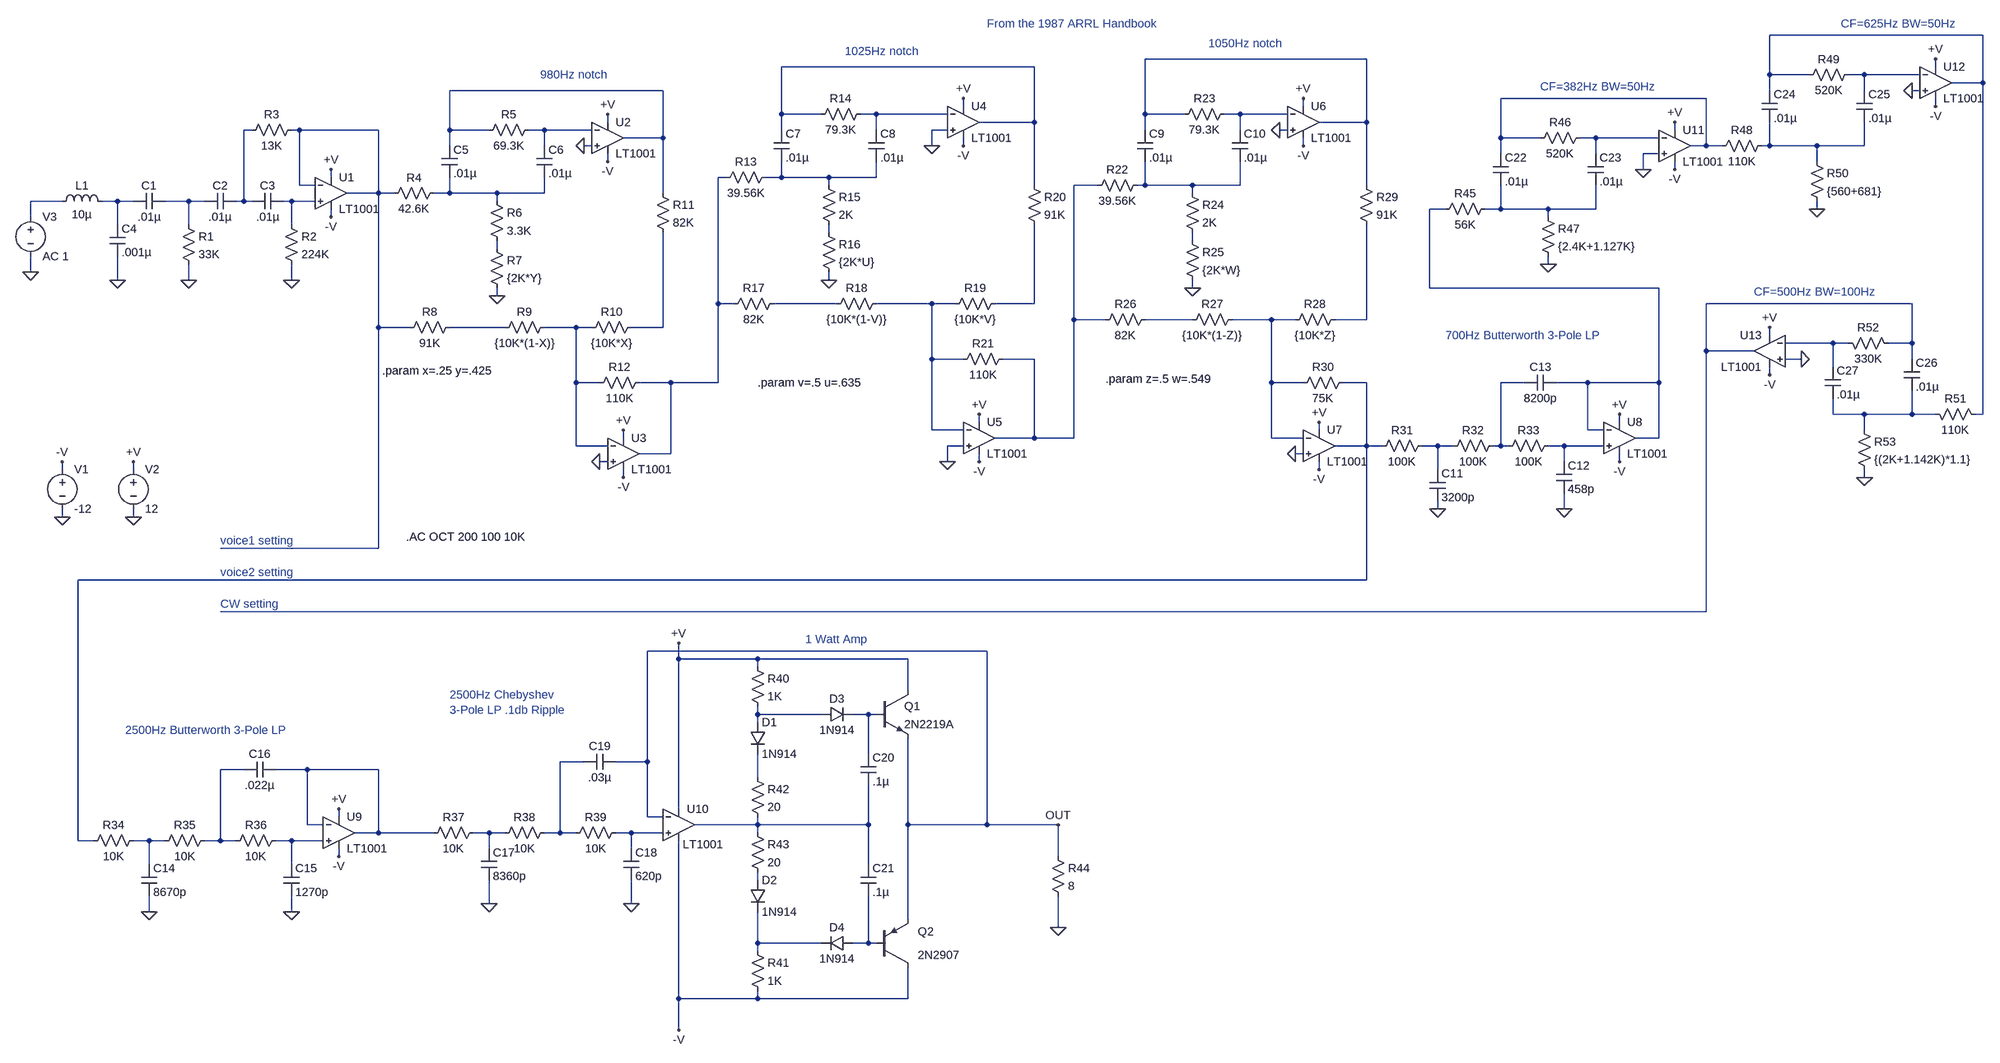
[diagram p0: schematic voice.asc]
voice.asc, the LTspice schematic file:
Version 4
SHEET 1 5368 2104
WIRE 4896 -64 4464 -64
WIRE 3648 -16 3200 -16
WIRE 2976 0 2464 0
WIRE 4800 0 4800 -16
WIRE 4464 16 4464 -64
WIRE 4544 16 4464 16
WIRE 4656 16 4624 16
WIRE 4768 16 4656 16
WIRE 4896 32 4896 -64
WIRE 4896 32 4832 32
WIRE 2224 48 1792 48
WIRE 4464 48 4464 16
WIRE 4656 48 4656 16
WIRE 4768 48 4752 48
WIRE 4336 64 3920 64
WIRE 2832 80 2832 64
WIRE 3520 80 3520 64
WIRE 4800 80 4800 64
WIRE 2464 96 2464 0
WIRE 2544 96 2464 96
WIRE 2656 96 2624 96
WIRE 2800 96 2656 96
WIRE 3200 96 3200 -16
WIRE 3280 96 3200 96
WIRE 3392 96 3360 96
WIRE 3488 96 3392 96
WIRE 2112 112 2112 96
WIRE 2976 112 2976 0
WIRE 2976 112 2864 112
WIRE 3648 112 3648 -16
WIRE 3648 112 3552 112
WIRE 1392 128 1376 128
WIRE 1488 128 1472 128
WIRE 1648 128 1488 128
WIRE 1792 128 1792 48
WIRE 1872 128 1792 128
WIRE 1984 128 1952 128
WIRE 2080 128 1984 128
WIRE 2464 128 2464 96
WIRE 2656 128 2656 96
WIRE 2800 128 2768 128
WIRE 3200 128 3200 96
WIRE 3392 128 3392 96
WIRE 3488 128 3472 128
WIRE 4272 128 4272 112
WIRE 2224 144 2224 48
WIRE 2224 144 2144 144
WIRE 3920 144 3920 64
WIRE 4000 144 3920 144
WIRE 4112 144 4080 144
WIRE 4240 144 4112 144
WIRE 1792 160 1792 128
WIRE 1984 160 1984 128
WIRE 2080 160 2064 160
WIRE 2768 160 2768 128
WIRE 2832 160 2832 144
WIRE 3520 160 3520 144
WIRE 4336 160 4336 64
WIRE 4336 160 4304 160
WIRE 4368 160 4336 160
WIRE 4464 160 4464 112
WIRE 4464 160 4448 160
WIRE 4560 160 4464 160
WIRE 4656 160 4656 112
WIRE 4656 160 4560 160
WIRE 3920 176 3920 144
WIRE 4112 176 4112 144
WIRE 4240 176 4208 176
WIRE 2112 192 2112 176
WIRE 4560 192 4560 160
WIRE 4208 208 4208 176
WIRE 4272 208 4272 192
WIRE 1552 224 1552 208
WIRE 2352 224 2336 224
WIRE 2464 224 2464 192
WIRE 2464 224 2432 224
WIRE 2560 224 2464 224
WIRE 2656 224 2656 192
WIRE 2656 224 2560 224
WIRE 1488 240 1488 128
WIRE 1520 240 1488 240
WIRE 2560 240 2560 224
WIRE 2976 240 2976 112
WIRE 3104 240 3056 240
WIRE 3200 240 3200 192
WIRE 3200 240 3184 240
WIRE 3296 240 3200 240
WIRE 3392 240 3392 192
WIRE 3392 240 3296 240
WIRE 3648 240 3648 112
WIRE 1648 256 1648 128
WIRE 1648 256 1584 256
WIRE 1680 256 1648 256
WIRE 1792 256 1792 224
WIRE 1792 256 1760 256
WIRE 1888 256 1792 256
WIRE 1984 256 1984 224
WIRE 1984 256 1888 256
WIRE 2224 256 2224 144
WIRE 3296 256 3296 240
WIRE 1008 272 944 272
WIRE 1120 272 1088 272
WIRE 1152 272 1120 272
WIRE 1264 272 1216 272
WIRE 1296 272 1264 272
WIRE 1376 272 1376 128
WIRE 1376 272 1360 272
WIRE 1392 272 1376 272
WIRE 1472 272 1456 272
WIRE 1520 272 1472 272
WIRE 1888 272 1888 256
WIRE 3808 288 3776 288
WIRE 3920 288 3920 240
WIRE 3920 288 3888 288
WIRE 4016 288 3920 288
WIRE 4112 288 4112 240
WIRE 4112 288 4016 288
WIRE 4560 288 4560 272
WIRE 944 304 944 272
WIRE 1552 304 1552 288
WIRE 4016 304 4016 288
WIRE 1120 320 1120 272
WIRE 1264 320 1264 272
WIRE 1472 320 1472 272
WIRE 2560 336 2560 320
WIRE 3296 352 3296 336
WIRE 1888 368 1888 352
WIRE 4016 400 4016 384
WIRE 944 416 944 384
WIRE 1120 432 1120 384
WIRE 1264 432 1264 400
WIRE 1472 432 1472 400
WIRE 2560 432 2560 416
WIRE 3296 448 3296 432
WIRE 3776 448 3776 288
WIRE 4240 448 3776 448
WIRE 1888 464 1888 448
WIRE 2336 480 2336 224
WIRE 2368 480 2336 480
WIRE 2576 480 2448 480
WIRE 2768 480 2656 480
WIRE 2816 480 2768 480
WIRE 2976 480 2976 320
WIRE 2976 480 2896 480
WIRE 4752 480 4336 480
WIRE 3056 512 3056 240
WIRE 3120 512 3056 512
WIRE 3296 512 3200 512
WIRE 3456 512 3376 512
WIRE 3504 512 3456 512
WIRE 3648 512 3648 320
WIRE 3648 512 3584 512
WIRE 1648 528 1648 256
WIRE 1712 528 1648 528
WIRE 1904 528 1792 528
WIRE 2048 528 1984 528
WIRE 2080 528 2048 528
WIRE 2224 528 2224 336
WIRE 2224 528 2160 528
WIRE 4464 544 4464 528
WIRE 4592 560 4496 560
WIRE 4624 560 4592 560
WIRE 4752 560 4752 480
WIRE 4752 560 4704 560
WIRE 4336 576 4336 480
WIRE 4432 576 4336 576
WIRE 2768 592 2768 480
WIRE 2832 592 2768 592
WIRE 2976 592 2912 592
WIRE 4528 592 4496 592
WIRE 4752 592 4752 560
WIRE 4592 608 4592 560
WIRE 4464 624 4464 608
WIRE 2048 640 2048 528
WIRE 2096 640 2048 640
WIRE 2240 640 2176 640
WIRE 2336 640 2336 480
WIRE 2336 640 2240 640
WIRE 3456 640 3456 512
WIRE 3520 640 3456 640
WIRE 3648 640 3600 640
WIRE 3968 640 3920 640
WIRE 4096 640 4032 640
WIRE 4240 640 4240 448
WIRE 4240 640 4096 640
WIRE 4592 704 4592 672
WIRE 4656 704 4592 704
WIRE 4752 704 4752 656
WIRE 4752 704 4656 704
WIRE 4800 704 4752 704
WIRE 4896 704 4896 32
WIRE 4896 704 4880 704
WIRE 2864 720 2864 704
WIRE 4160 720 4160 704
WIRE 2768 736 2768 592
WIRE 2832 736 2768 736
WIRE 3552 736 3552 720
WIRE 4096 736 4096 640
WIRE 4128 736 4096 736
WIRE 4656 736 4656 704
WIRE 2144 752 2144 736
WIRE 2976 752 2976 592
WIRE 2976 752 2896 752
WIRE 3056 752 3056 512
WIRE 3056 752 2976 752
WIRE 3456 752 3456 640
WIRE 3520 752 3456 752
WIRE 4240 752 4240 640
WIRE 4240 752 4192 752
WIRE 2048 768 2048 640
WIRE 2112 768 2048 768
WIRE 2832 768 2800 768
WIRE 3648 768 3648 640
WIRE 3648 768 3584 768
WIRE 3680 768 3648 768
WIRE 3792 768 3760 768
WIRE 3824 768 3792 768
WIRE 3920 768 3920 640
WIRE 3920 768 3904 768
WIRE 3936 768 3920 768
WIRE 4048 768 4016 768
WIRE 4128 768 4048 768
WIRE 2240 784 2240 640
WIRE 2240 784 2176 784
WIRE 3520 784 3504 784
WIRE 2112 800 2096 800
WIRE 2800 800 2800 768
WIRE 2864 800 2864 784
WIRE 4048 800 4048 768
WIRE 4160 800 4160 784
WIRE 1008 816 1008 800
WIRE 1152 816 1152 800
WIRE 3552 816 3552 800
WIRE 3792 816 3792 768
WIRE 2144 832 2144 816
WIRE 4656 832 4656 816
WIRE 3792 896 3792 880
WIRE 4048 896 4048 864
WIRE 1008 912 1008 896
WIRE 1152 912 1152 896
WIRE 1648 976 1648 528
WIRE 1648 976 1328 976
WIRE 3648 1040 3648 768
WIRE 3648 1040 1040 1040
WIRE 4336 1104 4336 576
WIRE 4336 1104 1328 1104
WIRE 2880 1184 2192 1184
WIRE 2256 1200 2256 1168
WIRE 2416 1200 2256 1200
WIRE 2720 1200 2416 1200
WIRE 2416 1216 2416 1200
WIRE 2720 1264 2720 1200
WIRE 2416 1312 2416 1296
WIRE 2544 1312 2416 1312
WIRE 2640 1312 2608 1312
WIRE 2656 1312 2640 1312
WIRE 2416 1328 2416 1312
WIRE 2640 1392 2640 1312
WIRE 2064 1408 2016 1408
WIRE 2192 1408 2192 1184
WIRE 2192 1408 2128 1408
WIRE 1376 1424 1328 1424
WIRE 1504 1424 1440 1424
WIRE 1648 1424 1504 1424
WIRE 2416 1440 2416 1392
WIRE 2256 1504 2256 1200
WIRE 1568 1520 1568 1504
WIRE 2192 1520 2192 1408
WIRE 2224 1520 2192 1520
WIRE 1504 1536 1504 1424
WIRE 1536 1536 1504 1536
WIRE 2416 1536 2416 1520
WIRE 2416 1536 2288 1536
WIRE 2640 1536 2640 1456
WIRE 2640 1536 2416 1536
WIRE 2720 1536 2720 1360
WIRE 2880 1536 2880 1184
WIRE 2880 1536 2720 1536
WIRE 3024 1536 2880 1536
WIRE 1648 1552 1648 1424
WIRE 1648 1552 1600 1552
WIRE 1760 1552 1648 1552
WIRE 1872 1552 1840 1552
WIRE 1904 1552 1872 1552
WIRE 2016 1552 2016 1408
WIRE 2016 1552 1984 1552
WIRE 2048 1552 2016 1552
WIRE 2160 1552 2128 1552
WIRE 2224 1552 2160 1552
WIRE 2416 1552 2416 1536
WIRE 1040 1568 1040 1040
WIRE 1072 1568 1040 1568
WIRE 1184 1568 1152 1568
WIRE 1216 1568 1184 1568
WIRE 1328 1568 1328 1424
WIRE 1328 1568 1296 1568
WIRE 1360 1568 1328 1568
WIRE 1472 1568 1440 1568
WIRE 1536 1568 1472 1568
WIRE 1872 1584 1872 1552
WIRE 2160 1584 2160 1552
WIRE 1568 1600 1568 1584
WIRE 3024 1600 3024 1536
WIRE 1184 1616 1184 1568
WIRE 1472 1616 1472 1568
WIRE 2640 1616 2640 1536
WIRE 2416 1648 2416 1632
WIRE 1872 1696 1872 1648
WIRE 2160 1696 2160 1648
WIRE 1184 1712 1184 1680
WIRE 1472 1712 1472 1680
WIRE 2720 1728 2720 1536
WIRE 3024 1744 3024 1680
WIRE 2416 1776 2416 1712
WIRE 2544 1776 2416 1776
WIRE 2640 1776 2640 1680
WIRE 2640 1776 2608 1776
WIRE 2656 1776 2640 1776
WIRE 2416 1792 2416 1776
WIRE 2256 1888 2256 1568
WIRE 2416 1888 2416 1872
WIRE 2416 1888 2256 1888
WIRE 2720 1888 2720 1824
WIRE 2720 1888 2416 1888
WIRE 2256 1952 2256 1888
FLAG 1552 208 +V
FLAG 1552 304 -V
FLAG 1152 800 +V
FLAG 1008 800 -V
FLAG 1152 912 0
FLAG 1008 912 0
FLAG 1472 432 0
FLAG 1264 432 0
FLAG 1120 432 0
FLAG 944 416 0
FLAG 2112 96 +V
FLAG 2112 192 -V
FLAG 2064 160 0
FLAG 1888 464 0
FLAG 2144 736 +V
FLAG 2144 832 -V
FLAG 2096 800 0
FLAG 2832 64 +V
FLAG 2832 160 -V
FLAG 2768 160 0
FLAG 2560 432 0
FLAG 2864 704 +V
FLAG 2864 800 -V
FLAG 2800 800 0
FLAG 3520 64 +V
FLAG 3520 160 -V
FLAG 3472 128 0
FLAG 3296 448 0
FLAG 3552 720 +V
FLAG 3552 816 -V
FLAG 3504 784 0
FLAG 4160 704 +V
FLAG 4160 800 -V
FLAG 3792 896 0
FLAG 4048 896 0
FLAG 1568 1504 +V
FLAG 1568 1600 -V
FLAG 1184 1712 0
FLAG 1472 1712 0
FLAG 1872 1696 0
FLAG 2160 1696 0
FLAG 2256 1168 +V
FLAG 2256 1952 -V
FLAG 3024 1744 0
FLAG 4272 112 +V
FLAG 4272 208 -V
FLAG 4208 208 0
FLAG 4016 400 0
FLAG 4800 -16 +V
FLAG 4800 80 -V
FLAG 4752 48 0
FLAG 4560 288 0
FLAG 4464 528 +V
FLAG 4464 624 -V
FLAG 4528 592 0
FLAG 4656 832 0
FLAG 3024 1536 OUT
SYMBOL res 1248 304 R0
SYMATTR InstName R1
SYMATTR Value 33K
SYMBOL res 1456 304 R0
SYMATTR InstName R2
SYMATTR Value 224K
SYMBOL cap 1216 256 R90
WINDOW 0 0 32 VBottom 2
WINDOW 3 32 32 VTop 2
SYMATTR InstName C1
SYMATTR Value .01µ
SYMBOL cap 1360 256 R90
WINDOW 0 0 32 VBottom 2
WINDOW 3 32 32 VTop 2
SYMATTR InstName C2
SYMATTR Value .01µ
SYMBOL cap 1456 256 R90
WINDOW 0 0 32 VBottom 2
WINDOW 3 32 32 VTop 2
SYMATTR InstName C3
SYMATTR Value .01µ
SYMBOL cap 1104 320 R0
SYMATTR InstName C4
SYMATTR Value .001µ
SYMBOL opamps\\LT1001 1552 192 R0
SYMATTR InstName U1
SYMBOL voltage 1008 800 R0
SYMATTR InstName V1
SYMATTR Value -12
SYMBOL voltage 1152 800 R0
SYMATTR InstName V2
SYMATTR Value 12
SYMBOL voltage 944 288 R0
SYMATTR InstName V3
SYMATTR Value AC 1
SYMBOL res 1488 112 R90
WINDOW 0 0 56 VBottom 2
WINDOW 3 32 56 VTop 2
SYMATTR InstName R3
SYMATTR Value 13K
SYMBOL ind 992 288 R270
WINDOW 0 32 56 VTop 2
WINDOW 3 5 56 VBottom 2
SYMATTR InstName L1
SYMATTR Value 10µ
SYMBOL res 1776 240 R90
WINDOW 0 0 56 VBottom 2
WINDOW 3 32 56 VTop 2
SYMATTR InstName R4
SYMATTR Value 42.6K
SYMBOL opamps\\LT1001 2112 80 R0
SYMATTR InstName U2
SYMBOL res 1968 112 R90
WINDOW 0 0 56 VBottom 2
WINDOW 3 32 56 VTop 2
SYMATTR InstName R5
SYMATTR Value 69.3K
SYMBOL cap 1776 160 R0
SYMATTR InstName C5
SYMATTR Value .01µ
SYMBOL cap 1968 160 R0
SYMATTR InstName C6
SYMATTR Value .01µ
SYMBOL res 1872 256 R0
SYMATTR InstName R6
SYMATTR Value 3.3K
SYMBOL res 1872 352 R0
SYMATTR InstName R7
SYMATTR Value {2K*Y}
SYMBOL res 1808 512 R90
WINDOW 0 0 56 VBottom 2
WINDOW 3 32 56 VTop 2
SYMATTR InstName R8
SYMATTR Value 91K
SYMBOL res 2000 512 R90
WINDOW 0 0 56 VBottom 2
WINDOW 3 32 56 VTop 2
SYMATTR InstName R9
SYMATTR Value {10K*(1-X)}
SYMBOL res 2176 512 R90
WINDOW 0 0 56 VBottom 2
WINDOW 3 32 56 VTop 2
SYMATTR InstName R10
SYMATTR Value {10K*X}
SYMBOL res 2208 240 R0
SYMATTR InstName R11
SYMATTR Value 82K
SYMBOL opamps\\LT1001 2144 720 R0
SYMATTR InstName U3
SYMBOL res 2192 624 R90
WINDOW 0 0 56 VBottom 2
WINDOW 3 32 56 VTop 2
SYMATTR InstName R12
SYMATTR Value 110K
SYMBOL res 2448 208 R90
WINDOW 0 0 56 VBottom 2
WINDOW 3 32 56 VTop 2
SYMATTR InstName R13
SYMATTR Value 39.56K
SYMBOL opamps\\LT1001 2832 48 R0
SYMATTR InstName U4
SYMBOL res 2640 80 R90
WINDOW 0 0 56 VBottom 2
WINDOW 3 32 56 VTop 2
SYMATTR InstName R14
SYMATTR Value 79.3K
SYMBOL cap 2448 128 R0
SYMATTR InstName C7
SYMATTR Value .01µ
SYMBOL cap 2640 128 R0
SYMATTR InstName C8
SYMATTR Value .01µ
SYMBOL res 2544 224 R0
SYMATTR InstName R15
SYMATTR Value 2K
SYMBOL res 2544 320 R0
SYMATTR InstName R16
SYMATTR Value {2K*U}
SYMBOL res 2464 464 R90
WINDOW 0 0 56 VBottom 2
WINDOW 3 32 56 VTop 2
SYMATTR InstName R17
SYMATTR Value 82K
SYMBOL res 2672 464 R90
WINDOW 0 0 56 VBottom 2
WINDOW 3 32 56 VTop 2
SYMATTR InstName R18
SYMATTR Value {10K*(1-V)}
SYMBOL res 2912 464 R90
WINDOW 0 0 56 VBottom 2
WINDOW 3 32 56 VTop 2
SYMATTR InstName R19
SYMATTR Value {10K*V}
SYMBOL res 2960 224 R0
SYMATTR InstName R20
SYMATTR Value 91K
SYMBOL opamps\\LT1001 2864 688 R0
SYMATTR InstName U5
SYMBOL res 2928 576 R90
WINDOW 0 0 56 VBottom 2
WINDOW 3 32 56 VTop 2
SYMATTR InstName R21
SYMATTR Value 110K
SYMBOL res 3200 224 R90
WINDOW 0 0 56 VBottom 2
WINDOW 3 32 56 VTop 2
SYMATTR InstName R22
SYMATTR Value 39.56K
SYMBOL opamps\\LT1001 3520 48 R0
SYMATTR InstName U6
SYMBOL res 3376 80 R90
WINDOW 0 0 56 VBottom 2
WINDOW 3 32 56 VTop 2
SYMATTR InstName R23
SYMATTR Value 79.3K
SYMBOL cap 3184 128 R0
SYMATTR InstName C9
SYMATTR Value .01µ
SYMBOL cap 3376 128 R0
SYMATTR InstName C10
SYMATTR Value .01µ
SYMBOL res 3280 240 R0
SYMATTR InstName R24
SYMATTR Value 2K
SYMBOL res 3280 336 R0
SYMATTR InstName R25
SYMATTR Value {2K*W}
SYMBOL res 3216 496 R90
WINDOW 0 0 56 VBottom 2
WINDOW 3 32 56 VTop 2
SYMATTR InstName R26
SYMATTR Value 82K
SYMBOL res 3392 496 R90
WINDOW 0 0 56 VBottom 2
WINDOW 3 32 56 VTop 2
SYMATTR InstName R27
SYMATTR Value {10K*(1-Z)}
SYMBOL res 3600 496 R90
WINDOW 0 0 56 VBottom 2
WINDOW 3 32 56 VTop 2
SYMATTR InstName R28
SYMATTR Value {10K*Z}
SYMBOL res 3632 224 R0
SYMATTR InstName R29
SYMATTR Value 91K
SYMBOL opamps\\LT1001 3552 704 R0
SYMATTR InstName U7
SYMBOL res 3616 624 R90
WINDOW 0 0 56 VBottom 2
WINDOW 3 32 56 VTop 2
SYMATTR InstName R30
SYMATTR Value 75K
SYMBOL opamps\\LT1001 4160 688 R0
SYMATTR InstName U8
SYMBOL res 3776 752 R90
WINDOW 0 0 56 VBottom 2
WINDOW 3 32 56 VTop 2
SYMATTR InstName R31
SYMATTR Value 100K
SYMBOL res 3920 752 R90
WINDOW 0 0 56 VBottom 2
WINDOW 3 32 56 VTop 2
SYMATTR InstName R32
SYMATTR Value 100K
SYMBOL res 4032 752 R90
WINDOW 0 0 56 VBottom 2
WINDOW 3 32 56 VTop 2
SYMATTR InstName R33
SYMATTR Value 100K
SYMBOL cap 3776 816 R0
SYMATTR InstName C11
SYMATTR Value 3200p
SYMBOL cap 4032 800 R0
SYMATTR InstName C12
SYMATTR Value 458p
SYMBOL cap 4032 624 R90
WINDOW 0 0 32 VBottom 2
WINDOW 3 32 32 VTop 2
SYMATTR InstName C13
SYMATTR Value 8200p
SYMBOL opamps\\LT1001 1568 1488 R0
SYMATTR InstName U9
SYMBOL res 1168 1552 R90
WINDOW 0 0 56 VBottom 2
WINDOW 3 32 56 VTop 2
SYMATTR InstName R34
SYMATTR Value 10K
SYMBOL res 1312 1552 R90
WINDOW 0 0 56 VBottom 2
WINDOW 3 32 56 VTop 2
SYMATTR InstName R35
SYMATTR Value 10K
SYMBOL res 1456 1552 R90
WINDOW 0 0 56 VBottom 2
WINDOW 3 32 56 VTop 2
SYMATTR InstName R36
SYMATTR Value 10K
SYMBOL cap 1168 1616 R0
SYMATTR InstName C14
SYMATTR Value 8670p
SYMBOL cap 1456 1616 R0
SYMATTR InstName C15
SYMATTR Value 1270p
SYMBOL cap 1440 1408 R90
WINDOW 0 0 32 VBottom 2
WINDOW 3 32 32 VTop 2
SYMATTR InstName C16
SYMATTR Value .022µ
SYMBOL res 1856 1536 R90
WINDOW 0 0 56 VBottom 2
WINDOW 3 32 56 VTop 2
SYMATTR InstName R37
SYMATTR Value 10K
SYMBOL res 2000 1536 R90
WINDOW 0 0 56 VBottom 2
WINDOW 3 32 56 VTop 2
SYMATTR InstName R38
SYMATTR Value 10K
SYMBOL res 2144 1536 R90
WINDOW 0 0 56 VBottom 2
WINDOW 3 32 56 VTop 2
SYMATTR InstName R39
SYMATTR Value 10K
SYMBOL cap 1856 1584 R0
SYMATTR InstName C17
SYMATTR Value 8360p
SYMBOL cap 2144 1584 R0
SYMATTR InstName C18
SYMATTR Value 620p
SYMBOL cap 2128 1392 R90
WINDOW 0 0 32 VBottom 2
WINDOW 3 32 32 VTop 2
SYMATTR InstName C19
SYMATTR Value .03µ
SYMBOL opamps\\LT1001 2256 1472 R0
WINDOW 3 8 104 Left 2
SYMATTR InstName U10
SYMBOL npn 2656 1264 R0
SYMATTR InstName Q1
SYMATTR Value 2N2219A
SYMBOL pnp 2656 1824 M180
WINDOW 0 84 72 Left 2
WINDOW 3 84 24 Left 2
SYMATTR InstName Q2
SYMATTR Value 2N2907
SYMBOL res 2400 1200 R0
SYMATTR InstName R40
SYMATTR Value 1K
SYMBOL res 2400 1776 R0
SYMATTR InstName R41
SYMATTR Value 1K
SYMBOL res 2400 1424 R0
SYMATTR InstName R42
SYMATTR Value 20
SYMBOL res 2400 1536 R0
SYMATTR InstName R43
SYMATTR Value 20
SYMBOL diode 2400 1328 R0
SYMATTR InstName D1
SYMATTR Value 1N914
SYMBOL diode 2400 1648 R0
SYMATTR InstName D2
SYMATTR Value 1N914
SYMBOL diode 2544 1328 R270
WINDOW 0 32 32 VTop 2
WINDOW 3 0 32 VBottom 2
SYMATTR InstName D3
SYMATTR Value 1N914
SYMBOL diode 2608 1792 M270
WINDOW 0 32 32 VTop 2
WINDOW 3 0 32 VBottom 2
SYMATTR InstName D4
SYMATTR Value 1N914
SYMBOL cap 2624 1392 R0
SYMATTR InstName C20
SYMATTR Value .1µ
SYMBOL cap 2624 1616 R0
SYMATTR InstName C21
SYMATTR Value .1µ
SYMBOL res 3008 1584 R0
SYMATTR InstName R44
SYMATTR Value 8
SYMBOL res 3904 272 R90
WINDOW 0 0 56 VBottom 2
WINDOW 3 32 56 VTop 2
SYMATTR InstName R45
SYMATTR Value 56K
SYMBOL opamps\\LT1001 4272 96 R0
SYMATTR InstName U11
SYMBOL res 4096 128 R90
WINDOW 0 0 56 VBottom 2
WINDOW 3 32 56 VTop 2
SYMATTR InstName R46
SYMATTR Value 520K
SYMBOL cap 3904 176 R0
SYMATTR InstName C22
SYMATTR Value .01µ
SYMBOL cap 4096 176 R0
SYMATTR InstName C23
SYMATTR Value .01µ
SYMBOL res 4000 288 R0
SYMATTR InstName R47
SYMATTR Value {2.4K+1.127K}
SYMBOL res 4464 144 R90
WINDOW 0 0 56 VBottom 2
WINDOW 3 32 56 VTop 2
SYMATTR InstName R48
SYMATTR Value 110K
SYMBOL opamps\\LT1001 4800 -32 R0
SYMATTR InstName U12
SYMBOL res 4640 0 R90
WINDOW 0 0 56 VBottom 2
WINDOW 3 32 56 VTop 2
SYMATTR InstName R49
SYMATTR Value 520K
SYMBOL cap 4448 48 R0
SYMATTR InstName C24
SYMATTR Value .01µ
SYMBOL cap 4640 48 R0
SYMATTR InstName C25
SYMATTR Value .01µ
SYMBOL res 4544 176 R0
SYMATTR InstName R50
SYMATTR Value {560+681}
SYMBOL res 4784 688 M90
WINDOW 0 0 56 VBottom 2
WINDOW 3 32 56 VTop 2
SYMATTR InstName R51
SYMATTR Value 110K
SYMBOL opamps\\LT1001 4464 512 M0
SYMATTR InstName U13
SYMBOL res 4608 544 M90
WINDOW 0 0 56 VBottom 2
WINDOW 3 32 56 VTop 2
SYMATTR InstName R52
SYMATTR Value 330K
SYMBOL cap 4736 592 R0
SYMATTR InstName C26
SYMATTR Value .01µ
SYMBOL cap 4576 608 R0
SYMATTR InstName C27
SYMATTR Value .01µ
SYMBOL res 4640 720 R0
SYMATTR InstName R53
SYMATTR Value {(2K+1.142K)*1.1}
TEXT 1704 952 Left 2 !.AC OCT 200 100 10K
TEXT 1656 616 Left 2 !.param x=.25 y=.425
TEXT 2416 640 Left 2 !.param v=.5 u=.635
TEXT 2592 -32 Left 2 ;1025Hz notch
TEXT 1976 16 Left 2 ;980Hz notch
TEXT 3808 544 Left 2 ;700Hz Butterworth 3-Pole LP
TEXT 3120 632 Left 2 !.param z=.5 w=.549
TEXT 3328 -48 Left 2 ;1050Hz notch
TEXT 1136 1344 Left 2 ;2500Hz Butterworth 3-Pole LP
TEXT 1792 1272 Left 2 ;2500Hz Chebyshev\n3-Pole LP .1db Ripple
TEXT 1328 960 Left 2 ;voice1 setting
TEXT 1328 1024 Left 2 ;voice2 setting
TEXT 4000 40 Left 2 ;CF=382Hz BW=50Hz
TEXT 4608 -88 Left 2 ;CF=625Hz BW=50Hz
TEXT 4432 456 Left 2 ;CF=500Hz BW=100Hz
TEXT 1328 1088 Left 2 ;CW setting
TEXT 2880 -88 Left 2 ;From the 1987 ARRL Handbook
TEXT 2512 1160 Left 2 ;1 Watt Amp

The netlist it stands for:
* voice.asc
R1 N021 0 33K
R2 N022 0 224K
C1 N021 N020 .01µ
C2 N009 N021 .01µ
C3 N022 N009 .01µ
C4 N020 0 .001µ
XU1 N022 N010 +V -V N010 LT1001  ; pins In+ In- V+ V- OUT
V1 -V 0 -12
V2 +V 0 12
V3 N019 0 AC 1
R3 N010 N009 13K
L1 N019 N020 10µ
R4 N018 N010 42.6K
XU2 0 N011 +V -V N005 LT1001  ; pins In+ In- V+ V- OUT
R5 N011 N005 69.3K
C5 N005 N018 .01µ
C6 N011 N018 .01µ
R6 N018 N027 3.3K
R7 N027 0 {2K*Y}
R8 N035 N010 91K
R9 N036 N035 {10K*(1-X)}
R10 N037 N036 {10K*X}
R11 N005 N037 82K
XU3 0 N036 +V -V N014 LT1001  ; pins In+ In- V+ V- OUT
R12 N014 N036 110K
R13 N015 N014 39.56K
XU4 0 N007 +V -V N003 LT1001  ; pins In+ In- V+ V- OUT
R14 N007 N003 79.3K
C7 N003 N015 .01µ
C8 N007 N015 .01µ
R15 N015 N025 2K
R16 N025 0 {2K*U}
R17 N028 N014 82K
R18 N029 N028 {10K*(1-V)}
R19 N030 N029 {10K*V}
R20 N003 N030 91K
XU5 0 N029 +V -V N016 LT1001  ; pins In+ In- V+ V- OUT
R21 N016 N029 110K
R22 N017 N016 39.56K
XU6 0 N008 +V -V N002 LT1001  ; pins In+ In- V+ V- OUT
R23 N008 N002 79.3K
C9 N002 N017 .01µ
C10 N008 N017 .01µ
R24 N017 N026 2K
R25 N026 0 {2K*W}
R26 N032 N016 82K
R27 N033 N032 {10K*(1-Z)}
R28 N034 N033 {10K*Z}
R29 N002 N034 91K
XU7 0 N033 +V -V N039 LT1001  ; pins In+ In- V+ V- OUT
R30 N039 N033 75K
XU8 N043 N023 +V -V N023 LT1001  ; pins In+ In- V+ V- OUT
R31 N042 N039 100K
R32 N040 N042 100K
R33 N043 N040 100K
C11 N042 0 3200p
C12 N043 0 458p
C13 N023 N040 8200p
XU9 N054 N048 +V -V N048 LT1001  ; pins In+ In- V+ V- OUT
R34 N053 N039 10K
R35 N047 N053 10K
R36 N054 N047 10K
C14 N053 0 8670p
C15 N054 0 1270p
C16 N048 N047 .022µ
R37 N051 N048 10K
R38 N046 N051 10K
R39 N052 N046 10K
C17 N051 0 8360p
C18 N052 0 620p
C19 OUT N046 .03µ
XU10 N052 OUT +V -V N050 LT1001  ; pins In+ In- V+ V- OUT
Q1 +V N045 OUT 0 2N2219A
Q2 -V N057 OUT 0 2N2907
R40 +V N044 1K
R41 N056 -V 1K
R42 N049 N050 20
R43 N050 N055 20
D1 N044 N049 1N914
D2 N055 N056 1N914
D3 N044 N045 1N914
D4 N057 N056 1N914
C20 N045 N050 .1µ
C21 N050 N057 .1µ
R44 OUT 0 8
R45 N024 N023 56K
XU11 0 N012 +V -V N006 LT1001  ; pins In+ In- V+ V- OUT
R46 N012 N006 520K
C22 N006 N024 .01µ
C23 N012 N024 .01µ
R47 N024 0 {2.4K+1.127K}
R48 N013 N006 110K
XU12 0 N004 +V -V N001 LT1001  ; pins In+ In- V+ V- OUT
R49 N004 N001 520K
C24 N001 N013 .01µ
C25 N004 N013 .01µ
R50 N013 0 {560+681}
R51 N041 N001 110K
XU13 0 N038 +V -V N031 LT1001  ; pins In+ In- V+ V- OUT
R52 N038 N031 330K
C26 N031 N041 .01µ
C27 N038 N041 .01µ
R53 N041 0 {(2K+1.142K)*1.1}
.model D D
.lib standard.dio
.model NPN NPN
.model PNP PNP
.lib standard.bjt
.AC OCT 200 100 10K
.param x=.25 y=.425
.param v=.5 u=.635
* 1025Hz notch
* 980Hz notch
* 700Hz Butterworth 3-Pole LP
.param z=.5 w=.549
* 1050Hz notch
* 2500Hz Butterworth 3-Pole LP
* 2500Hz Chebyshev
* 3-Pole LP .1db Ripple
* voice1 setting
* voice2 setting
* CF=382Hz BW=50Hz
* CF=625Hz BW=50Hz
* CF=500Hz BW=100Hz
* CW setting
* From the 1987 ARRL Handbook
* 1 Watt Amp
.lib LTC.lib
.backanno
.end